# Altium schematic sheet TCLab Shield V2I1.SchDoc
size A4; SheetNumber: 1; SheetTotal: 2
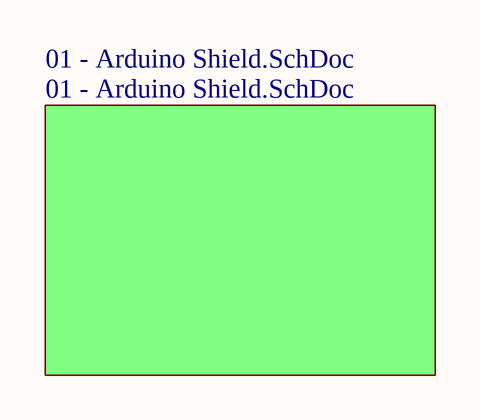
[diagram p0: TCLab Shield V2I1.SchDoc]

## Sub-sheets
01 - Arduino Shield.SchDoc = 01 - Arduino Shield.SchDoc: no entries